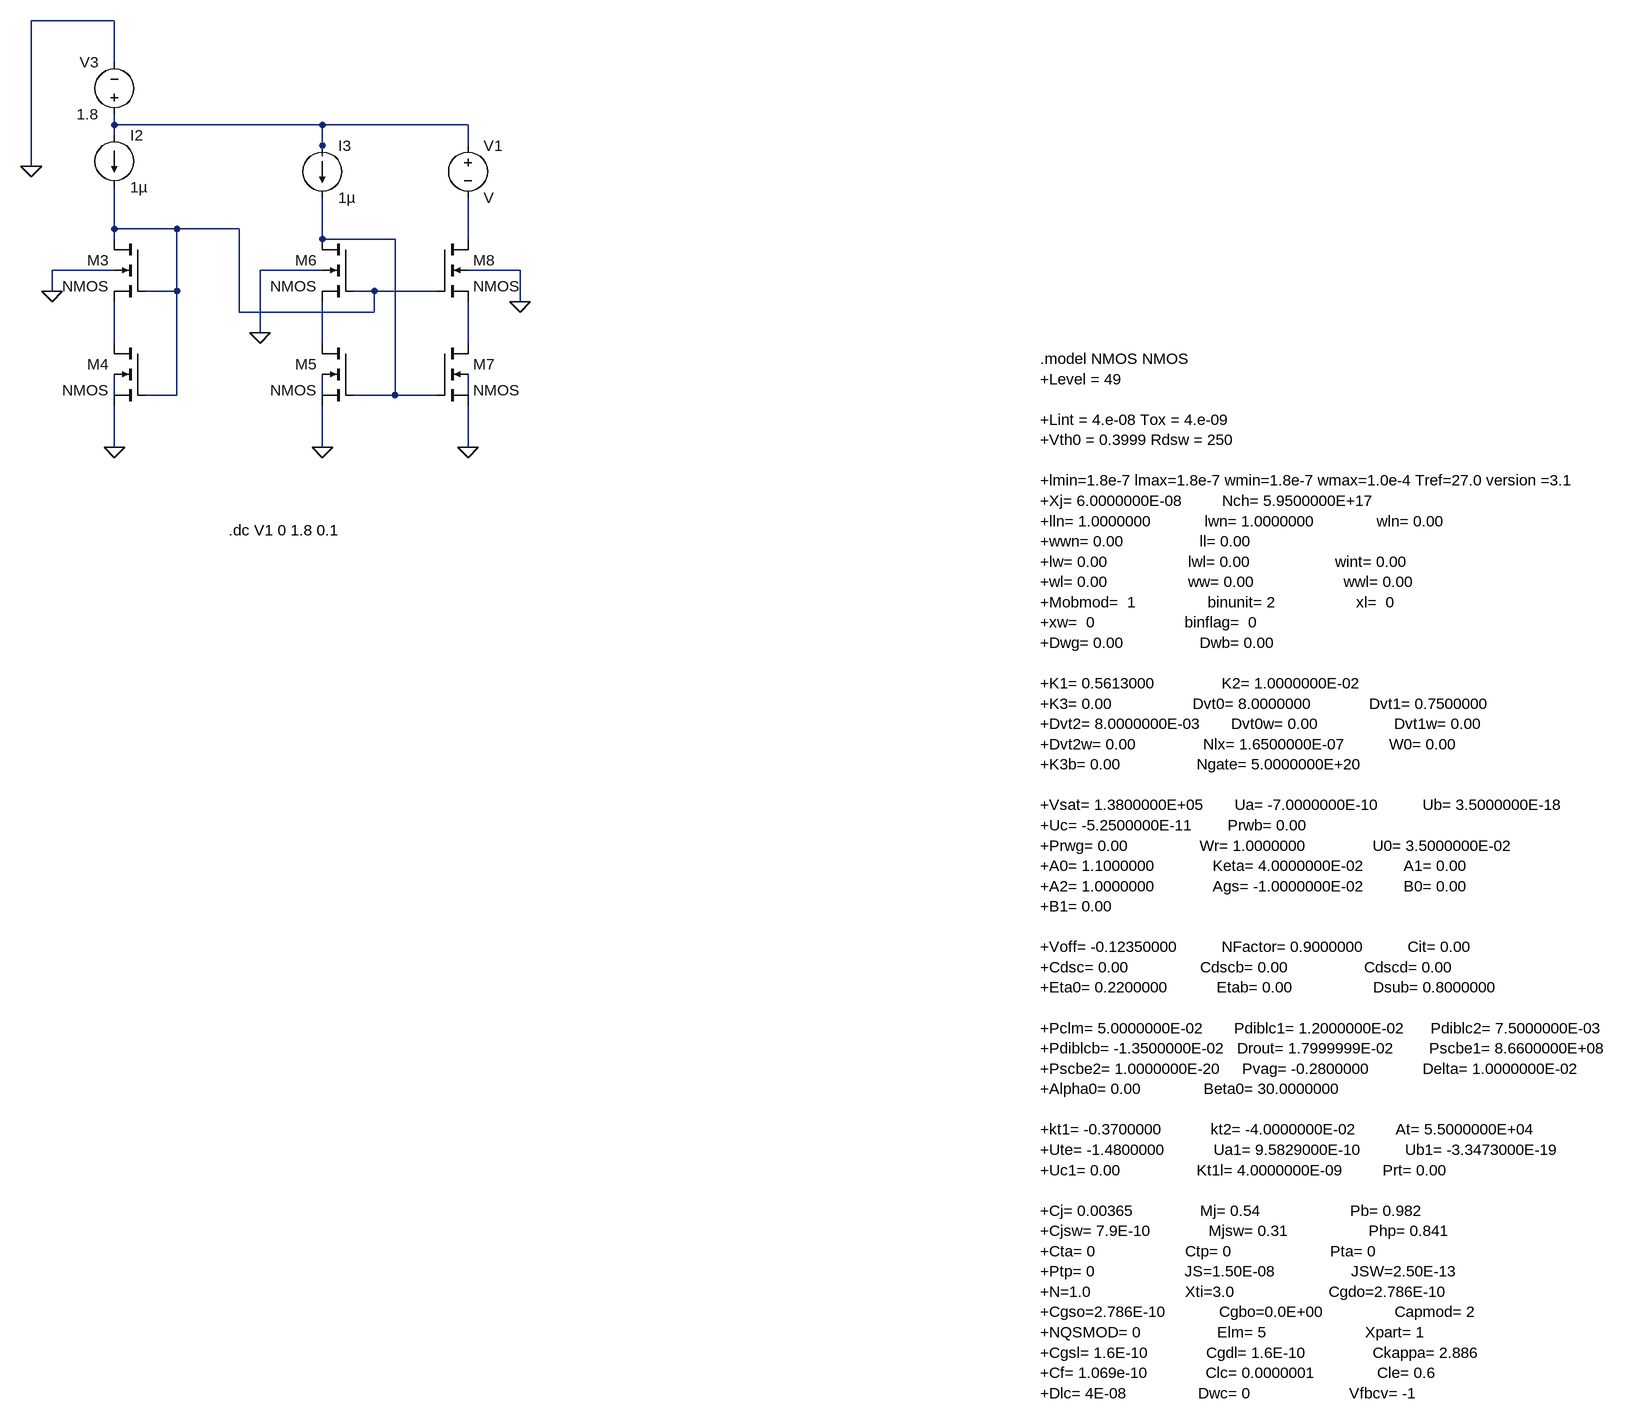
[diagram p0: schematic Q1(Bpart).asc]
Q1(Bpart).asc, the LTspice schematic file:
Version 4
SHEET 1 2284 1208
WIRE -64 -272 -192 -272
WIRE -64 -208 -64 -272
WIRE -64 -112 -64 -128
WIRE 256 -112 -64 -112
WIRE 480 -112 256 -112
WIRE -64 -96 -64 -112
WIRE 256 -80 256 -112
WIRE 480 -80 480 -112
WIRE 256 -64 256 -80
WIRE -192 -48 -192 -272
WIRE -64 48 -64 -16
WIRE 32 48 -64 48
WIRE 128 48 32 48
WIRE -64 64 -64 48
WIRE 256 64 256 0
WIRE 368 64 256 64
WIRE 480 64 480 0
WIRE 256 80 256 64
WIRE -64 112 -160 112
WIRE 256 112 160 112
WIRE 560 112 480 112
WIRE -160 144 -160 112
WIRE 32 144 32 48
WIRE 32 144 -16 144
WIRE 336 144 304 144
WIRE 432 144 336 144
WIRE 560 160 560 112
WIRE 128 176 128 48
WIRE 336 176 336 144
WIRE 336 176 128 176
WIRE 160 208 160 112
WIRE -64 224 -64 160
WIRE 256 224 256 160
WIRE 480 224 480 160
WIRE -64 304 -64 272
WIRE 32 304 32 144
WIRE 32 304 -16 304
WIRE 256 304 256 272
WIRE 368 304 368 64
WIRE 368 304 304 304
WIRE 432 304 368 304
WIRE 480 304 480 272
WIRE -64 384 -64 320
WIRE 256 384 256 320
WIRE 480 384 480 320
FLAG -192 -48 0
FLAG -64 384 0
FLAG 256 384 0
FLAG 480 384 0
FLAG 160 208 0
FLAG 560 160 0
FLAG -160 144 0
SYMBOL voltage -64 -112 R180
WINDOW 0 24 96 Left 2
WINDOW 3 24 16 Left 2
SYMATTR InstName V3
SYMATTR Value 1.8
SYMBOL nmos4 -16 64 M0
SYMATTR InstName M3
SYMATTR Value2 l=0.24u w=5u
SYMBOL nmos4 -16 224 M0
SYMATTR InstName M4
SYMATTR Value2 l=0.18u w=2u
SYMBOL current -64 -96 R0
SYMATTR InstName I2
SYMATTR Value 1µ
SYMBOL current 256 -80 R0
SYMATTR InstName I3
SYMATTR Value 1µ
SYMBOL nmos4 304 64 M0
SYMATTR InstName M6
SYMATTR Value2 l=0.18u w=2u
SYMBOL nmos4 304 224 M0
SYMATTR InstName M5
SYMATTR Value2 l=0.18u w=2u
SYMBOL voltage 480 -96 R0
SYMATTR InstName V1
SYMBOL nmos4 432 64 R0
SYMATTR InstName M8
SYMATTR Value2 l=0.18u w=2u
SYMBOL nmos4 432 224 R0
SYMATTR InstName M7
SYMATTR Value2 l=0.18u w=2u
TEXT 1360 248 Left 2 !.model NMOS NMOS\n+Level = 49\n\n+Lint = 4.e-08 Tox = 4.e-09 \n+Vth0 = 0.3999 Rdsw = 250 \n\n+lmin=1.8e-7 lmax=1.8e-7 wmin=1.8e-7 wmax=1.0e-4 Tref=27.0 version =3.1\n+Xj= 6.0000000E-08         Nch= 5.9500000E+17 \n+lln= 1.0000000            lwn= 1.0000000              wln= 0.00\n+wwn= 0.00                 ll= 0.00\n+lw= 0.00                  lwl= 0.00                   wint= 0.00\n+wl= 0.00                  ww= 0.00                    wwl= 0.00\n+Mobmod=  1                binunit= 2                  xl=  0\n+xw=  0                    binflag=  0\n+Dwg= 0.00                 Dwb= 0.00 \n\n+K1= 0.5613000               K2= 1.0000000E-02 \n+K3= 0.00                  Dvt0= 8.0000000             Dvt1= 0.7500000 \n+Dvt2= 8.0000000E-03       Dvt0w= 0.00                 Dvt1w= 0.00 \n+Dvt2w= 0.00               Nlx= 1.6500000E-07          W0= 0.00 \n+K3b= 0.00                 Ngate= 5.0000000E+20 \n\n+Vsat= 1.3800000E+05       Ua= -7.0000000E-10          Ub= 3.5000000E-18 \n+Uc= -5.2500000E-11        Prwb= 0.00 \n+Prwg= 0.00                Wr= 1.0000000               U0= 3.5000000E-02 \n+A0= 1.1000000             Keta= 4.0000000E-02         A1= 0.00 \n+A2= 1.0000000             Ags= -1.0000000E-02         B0= 0.00 \n+B1= 0.00 \n\n+Voff= -0.12350000          NFactor= 0.9000000          Cit= 0.00 \n+Cdsc= 0.00                Cdscb= 0.00                 Cdscd= 0.00 \n+Eta0= 0.2200000           Etab= 0.00                  Dsub= 0.8000000 \n\n+Pclm= 5.0000000E-02       Pdiblc1= 1.2000000E-02      Pdiblc2= 7.5000000E-03 \n+Pdiblcb= -1.3500000E-02   Drout= 1.7999999E-02        Pscbe1= 8.6600000E+08 \n+Pscbe2= 1.0000000E-20     Pvag= -0.2800000            Delta= 1.0000000E-02 \n+Alpha0= 0.00              Beta0= 30.0000000 \n\n+kt1= -0.3700000           kt2= -4.0000000E-02         At= 5.5000000E+04 \n+Ute= -1.4800000           Ua1= 9.5829000E-10          Ub1= -3.3473000E-19 \n+Uc1= 0.00                 Kt1l= 4.0000000E-09         Prt= 0.00 \n\n+Cj= 0.00365               Mj= 0.54                    Pb= 0.982\n+Cjsw= 7.9E-10             Mjsw= 0.31                  Php= 0.841\n+Cta= 0                    Ctp= 0                      Pta= 0\n+Ptp= 0                    JS=1.50E-08                 JSW=2.50E-13\n+N=1.0                     Xti=3.0                     Cgdo=2.786E-10\n+Cgso=2.786E-10            Cgbo=0.0E+00                Capmod= 2\n+NQSMOD= 0                 Elm= 5                      Xpart= 1\n+Cgsl= 1.6E-10             Cgdl= 1.6E-10               Ckappa= 2.886\n+Cf= 1.069e-10             Clc= 0.0000001              Cle= 0.6\n+Dlc= 4E-08                Dwc= 0                      Vfbcv= -1
TEXT 112 512 Left 2 !.dc V1 0 1.8 0.1

The netlist it stands for:
* Q1(Bpart).asc
V3 N001 0 1.8
M3 N002 N002 N005 0 NMOS l=0.24u w=5u
M4 N005 N002 0 N008 NMOS l=0.18u w=2u
I2 N001 N002 1µ
I3 N001 N003 1µ
M6 N003 N002 N006 0 NMOS l=0.18u w=2u
M5 N006 N003 0 N009 NMOS l=0.18u w=2u
V1 N001 N004 V
M8 N004 N002 N007 0 NMOS l=0.18u w=2u
M7 N007 N003 0 N010 NMOS l=0.18u w=2u
.model NMOS NMOS
.model PMOS PMOS
.lib standard.mos
.model NMOS NMOS
+Level = 49
+Lint = 4.e-08 Tox = 4.e-09
+Vth0 = 0.3999 Rdsw = 250
+lmin=1.8e-7 lmax=1.8e-7 wmin=1.8e-7 wmax=1.0e-4 Tref=27.0 version =3.1
+Xj= 6.0000000E-08         Nch= 5.9500000E+17
+lln= 1.0000000            lwn= 1.0000000              wln= 0.00
+wwn= 0.00                 ll= 0.00
+lw= 0.00                  lwl= 0.00                   wint= 0.00
+wl= 0.00                  ww= 0.00                    wwl= 0.00
+Mobmod=  1                binunit= 2                  xl=  0
+xw=  0                    binflag=  0
+Dwg= 0.00                 Dwb= 0.00
+K1= 0.5613000               K2= 1.0000000E-02
+K3= 0.00                  Dvt0= 8.0000000             Dvt1= 0.7500000
+Dvt2= 8.0000000E-03       Dvt0w= 0.00                 Dvt1w= 0.00
+Dvt2w= 0.00               Nlx= 1.6500000E-07          W0= 0.00
+K3b= 0.00                 Ngate= 5.0000000E+20
+Vsat= 1.3800000E+05       Ua= -7.0000000E-10          Ub= 3.5000000E-18
+Uc= -5.2500000E-11        Prwb= 0.00
+Prwg= 0.00                Wr= 1.0000000               U0= 3.5000000E-02
+A0= 1.1000000             Keta= 4.0000000E-02         A1= 0.00
+A2= 1.0000000             Ags= -1.0000000E-02         B0= 0.00
+B1= 0.00
+Voff= -0.12350000          NFactor= 0.9000000          Cit= 0.00
+Cdsc= 0.00                Cdscb= 0.00                 Cdscd= 0.00
+Eta0= 0.2200000           Etab= 0.00                  Dsub= 0.8000000
+Pclm= 5.0000000E-02       Pdiblc1= 1.2000000E-02      Pdiblc2= 7.5000000E-03
+Pdiblcb= -1.3500000E-02   Drout= 1.7999999E-02        Pscbe1= 8.6600000E+08
+Pscbe2= 1.0000000E-20     Pvag= -0.2800000            Delta= 1.0000000E-02
+Alpha0= 0.00              Beta0= 30.0000000
+kt1= -0.3700000           kt2= -4.0000000E-02         At= 5.5000000E+04
+Ute= -1.4800000           Ua1= 9.5829000E-10          Ub1= -3.3473000E-19
+Uc1= 0.00                 Kt1l= 4.0000000E-09         Prt= 0.00
+Cj= 0.00365               Mj= 0.54                    Pb= 0.982
+Cjsw= 7.9E-10             Mjsw= 0.31                  Php= 0.841
+Cta= 0                    Ctp= 0                      Pta= 0
+Ptp= 0                    JS=1.50E-08                 JSW=2.50E-13
+N=1.0                     Xti=3.0                     Cgdo=2.786E-10
+Cgso=2.786E-10            Cgbo=0.0E+00                Capmod= 2
+NQSMOD= 0                 Elm= 5                      Xpart= 1
+Cgsl= 1.6E-10             Cgdl= 1.6E-10               Ckappa= 2.886
+Cf= 1.069e-10             Clc= 0.0000001              Cle= 0.6
+Dlc= 4E-08                Dwc= 0                      Vfbcv= -1
.dc V1 0 1.8 0.1
.backanno
.end